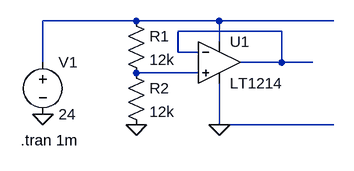
[diagram p0: schematic splitter.asc]
splitter.asc, the LTspice schematic file:
Version 4
SHEET 1 880 680
WIRE 224 32 80 32
WIRE 352 32 224 32
WIRE 528 32 352 32
WIRE 448 48 288 48
WIRE 352 64 352 32
WIRE 288 80 288 48
WIRE 320 80 288 80
WIRE 80 96 80 32
WIRE 448 96 448 48
WIRE 448 96 384 96
WIRE 496 96 448 96
WIRE 320 112 224 112
WIRE 352 192 352 128
WIRE 528 192 352 192
FLAG 80 176 0
FLAG 224 192 0
FLAG 352 192 0
SYMBOL voltage 80 80 R0
WINDOW 123 0 0 Left 0
WINDOW 39 0 0 Left 0
SYMATTR InstName V1
SYMATTR Value 24
SYMBOL res 208 16 R0
SYMATTR InstName R1
SYMATTR Value 12k
SYMBOL res 208 96 R0
SYMATTR InstName R2
SYMATTR Value 12k
SYMBOL Opamps\\LT1214 352 32 R0
SYMATTR InstName U1
TEXT 46 216 Left 2 !.tran 1m

The netlist it stands for:
* splitter.asc
V1 N001 0 24
R1 N001 N003 12k
R2 N003 0 12k
XU1 N003 N002 N001 0 N002 LT1213  ; LT1214, pins In+ In- V+ V- OUT
.tran 1m
.lib LTC.lib
.backanno
.end